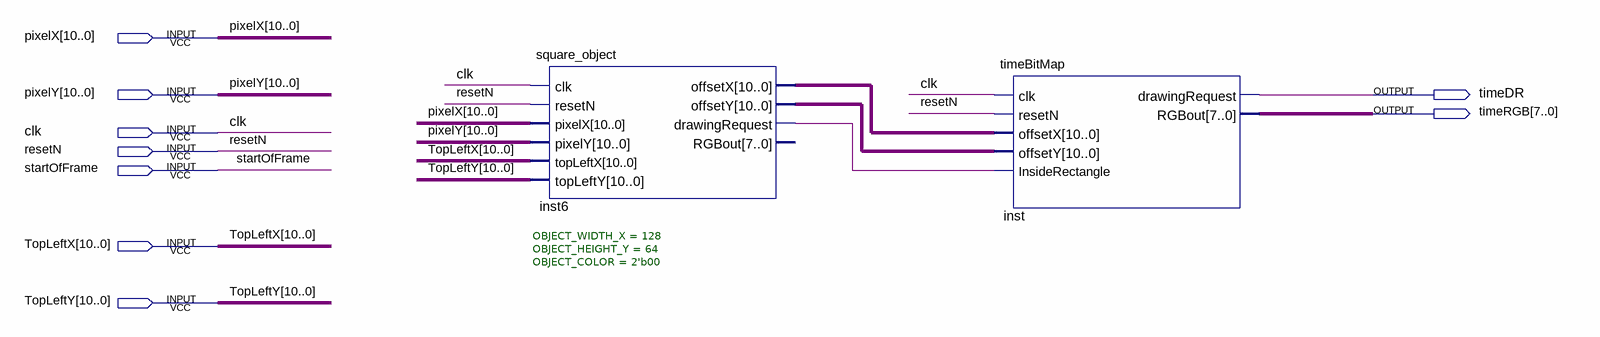
[diagram p0: schematic sheet]
// Quartus schematic TimeBlock.bdf as structural Verilog: 2 symbols, 9 pins
module TimeBlock (
  input  [10:0] pixelX,
  input  [10:0] pixelY,
  input  clk,
  input  resetN,
  input  startOfFrame,
  input  [10:0] TopLeftX,
  input  [10:0] TopLeftY,
  output timeDR,
  output [7:0] timeRGB
);

  wire inst6_drawingrequest;
  wire [10:0] inst6_offsetx, inst6_offsety;

  square_object #(.OBJECT_WIDTH_X(128), .OBJECT_HEIGHT_Y(64), .OBJECT_COLOR(2'b00)) inst6 (
    .clk(clk), .resetN(resetN), .pixelX(pixelX), .pixelY(pixelY), .topLeftX(TopLeftX), .topLeftY(TopLeftY),
    .offsetX(inst6_offsetx), .offsetY(inst6_offsety), .drawingRequest(inst6_drawingrequest));  // open: RGBout
  timeBitMap inst (
    .clk(clk), .resetN(resetN), .offsetX(inst6_offsetx), .offsetY(inst6_offsety),
    .InsideRectangle(inst6_drawingrequest), .drawingRequest(timeDR), .RGBout(timeRGB));
endmodule
